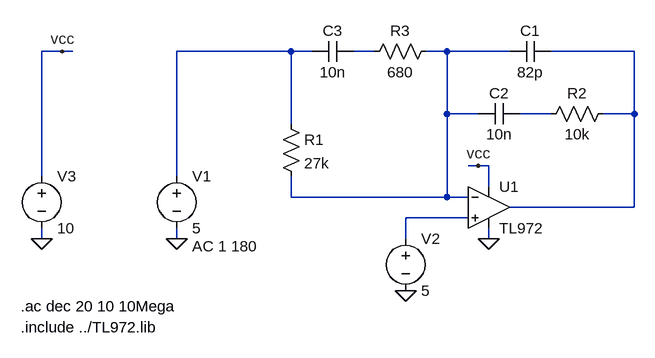
[diagram p0: schematic compensator.asc]
compensator.asc, the LTspice schematic file:
Version 4
SHEET 1 880 680
WIRE -176 -80 -208 -80
WIRE -160 -80 -176 -80
WIRE 176 -80 0 -80
WIRE 208 -80 176 -80
WIRE 304 -80 272 -80
WIRE 416 -80 384 -80
WIRE 512 -80 416 -80
WIRE 704 -80 576 -80
WIRE 416 16 416 -80
WIRE 464 16 416 16
WIRE 576 16 528 16
WIRE 704 16 704 -80
WIRE 704 16 656 16
WIRE 176 32 176 -80
WIRE 464 96 448 96
WIRE 480 96 464 96
WIRE -208 112 -208 -80
WIRE 0 112 0 -80
WIRE 480 128 480 96
WIRE 176 144 176 112
WIRE 416 144 416 16
WIRE 416 144 176 144
WIRE 448 144 416 144
WIRE 704 160 704 16
WIRE 704 160 512 160
WIRE 448 176 352 176
WIRE -208 208 -208 192
WIRE 0 208 0 192
WIRE 352 208 352 176
WIRE 480 208 480 192
FLAG 480 208 0
FLAG 464 96 vcc
FLAG 352 288 0
FLAG 0 208 0
FLAG -208 208 0
FLAG -176 -80 vcc
SYMBOL voltage 0 96 R0
WINDOW 123 24 124 Left 2
WINDOW 39 0 0 Left 0
SYMATTR Value2 AC 1 180
SYMATTR InstName V1
SYMATTR Value 5
SYMBOL res 160 16 R0
SYMATTR InstName R1
SYMATTR Value 27k
SYMBOL res 672 0 R90
WINDOW 0 0 56 VBottom 2
WINDOW 3 32 56 VTop 2
SYMATTR InstName R2
SYMATTR Value 10k
SYMBOL res 400 -96 R90
WINDOW 0 0 56 VBottom 2
WINDOW 3 32 56 VTop 2
SYMATTR InstName R3
SYMATTR Value 680
SYMBOL cap 576 -96 R90
WINDOW 0 0 32 VBottom 2
WINDOW 3 32 32 VTop 2
SYMATTR InstName C1
SYMATTR Value 82p
SYMBOL cap 528 0 R90
WINDOW 0 0 32 VBottom 2
WINDOW 3 32 32 VTop 2
SYMATTR InstName C2
SYMATTR Value 10n
SYMBOL cap 272 -96 R90
WINDOW 0 0 32 VBottom 2
WINDOW 3 32 32 VTop 2
SYMATTR InstName C3
SYMATTR Value 10n
SYMBOL voltage 352 192 R0
WINDOW 123 0 0 Left 0
WINDOW 39 0 0 Left 0
SYMATTR InstName V2
SYMATTR Value 5
SYMBOL voltage -208 96 R0
WINDOW 123 0 0 Left 0
WINDOW 39 0 0 Left 0
SYMATTR InstName V3
SYMATTR Value 10
SYMBOL OpAmps\\opamp2 480 96 R0
SYMATTR InstName U1
SYMATTR Value TL972
TEXT -240 312 Left 2 !.ac dec 20 10 10Mega
TEXT -240 344 Left 2 !.include ../TL972.lib

The netlist it stands for:
* compensator.asc
V1 N001 0 5 AC 1 180
R1 N001 N003 27k
R2 N004 N005 10k
R3 N003 N002 680
C1 N004 N003 82p
C2 N005 N003 10n
C3 N002 N001 10n
V2 N006 0 5
V3 vcc 0 10
XU1 N006 N003 vcc 0 N004 TL972  ; pins In+ In- V+ V- OUT
.ac dec 20 10 10Mega
.include ../TL972.lib
.backanno
.end